# Altium schematic sheet ZCD.schdoc
size 253 x 78 mm
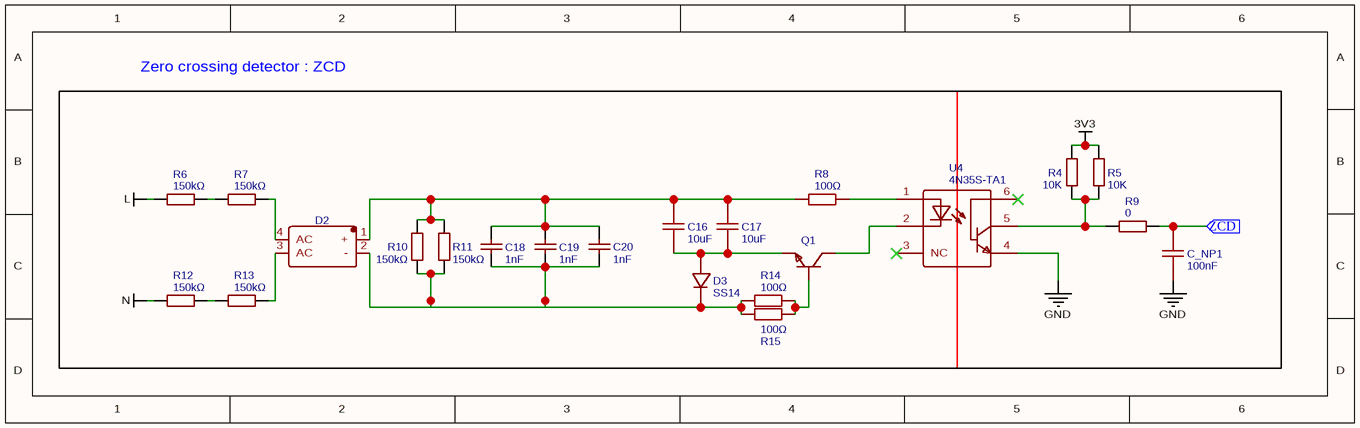
[diagram p0: ZCD.schdoc]

## Parts
C16  10uF  [C0805]
C17  10uF  [C0805]
C18  1nF  [C0603]
C19  1nF  [C0603]
C20  1nF  [C0603]
C_NP1  100nF  [C0603]
D2  MB6S_C211754  [MBS_L4.7-W3.8-P2.40-LS7.0-TL]  (value not drawn)
D3  SS14  [SMA_L4.4-W2.6-LS5.0-RD]
Q1  MMBT2222A,215  [SOT-23-3_L2.9-W1.6-P1.90-LS2.8-BR]  (value not drawn)
R4  10K  [R0603]
R5  10K  [R0603]
R6  150kΩ  [R1206]
R7  150kΩ  [R1206]
R8  100Ω  [R0603]
R9  0  [R0603]
R10  150kΩ  [R1206]
R11  150kΩ  [R1206]
R12  150kΩ  [R1206]
R13  150kΩ  [R1206]
R14  100Ω  [R0603]
R15  100Ω  [R0603]
U4  4N35S-TA1  [OPTO-SMD-6_L8.5-W6.5-P2.54-LS9.2-BL]

## Blocks framed on the sheet
Zero crossing detector : ZCD: C16-C20 C_NP1 D2 D3 Q1 R4-R15 U4

## Ports
ZCD (in)

## Nets
3V3: R4.2 R5.2
GND: C_NP1.2 U4.4
L: R6.1
N: R12.1
ZCD: C_NP1.1 R9.2 ; port ZCD
NetC16_1: C16.1 C17.1 D3.2(A) Q1.2(E)
NetC16_2: C16.2 C17.2 C18.2 C19.2 C20.2 D2.1(+) R8.1 R10.2 R11.2
NetC18_1: C18.1 C19.1 C20.1 D2.2(-) D3.1(C) R10.1 R11.1 R14.1 R15.2
NetD2_3: D2.3(AC) R13.2
NetD2_4: D2.4(AC) R7.2
NetQ1_1: Q1.1(B) R14.2 R15.1
NetQ1_3: Q1.3(C) U4.2(C)
NetR4_1: R4.1 R5.1 R9.1 U4.5
NetR6_2: R6.2 R7.1
NetR8_2: R8.2 U4.1(AN)
NetR12_2: R12.2 R13.1

Not connected (* = marked no-connect by the designer): U4 3(NC)* 6*

## Library data of the parts
C16 C17 = 10uF: BOM_Manufacturer: FH; BOM_Manufacturer Part: 0805F106M160NT; nameAlias: Capacitance; BOM_Supplier: LCSC; BOM_Supplier Part: C90545; BOM_JLCPCB Part Class: Extended Part; spicePre: C; spiceSymbolName: 0805F106M160NT
C18-C20 = 1nF: BOM_Manufacturer Part: CL10B102KB8NNNC; BOM_Manufacturer: SAMSUNG; nameAlias: Capacitance; BOM_Supplier: LCSC; BOM_Supplier Part: C1588; BOM_JLCPCB Part Class: Basic Part; spicePre: C; spiceSymbolName: CL10B102KB8NNNC
C_NP1 = 100nF: BOM_Manufacturer: SAMSUNG; BOM_Manufacturer Part: CL10B104KB8NNNC; nameAlias: Capacitance; BOM_Supplier: LCSC; BOM_Supplier Part: C1591; BOM_JLCPCB Part Class: Extended Part; spicePre: C; spiceSymbolName: CL10B104KB8NNNC
D2 = MB6S_C211754: BOM_Manufacturer: YANGJIE(扬杰); BOM_Manufacturer Part: MB6S; Contributor: LCSC; BOM_Supplier: LCSC; BOM_Supplier Part: C211754; BOM_JLCPCB Part Class: Extended Part; spicePre: D; spiceSymbolName: MB6S_C211754
D3 = SS14: BOM_Manufacturer: Jingdao; BOM_Supplier: LCSC; BOM_Manufacturer Part: SS14; BOM_Supplier Part: C112424; BOM_JLCPCB Part Class: Extended Part; spicePre: D; spiceSymbolName: SS14_C112424
Q1 = MMBT2222A,215: BOM_Manufacturer: Nexperia(安世); Contributor: LCSC; BOM_Supplier: LCSC; BOM_Manufacturer Part: MMBT2222A,215; BOM_Supplier Part: C179396; BOM_JLCPCB Part Class: Extended Part; spicePre: Q; spiceSymbolName: MMBT2222A,215
R4 R5 = 10K: BOM_Manufacturer: YAGEO; BOM_Manufacturer Part: RC0603FR-0710KL; nameAlias: Resistance (Ohms); Resistance: 10kΩ; BOM_Supplier: LCSC; BOM_Supplier Part: C98220; BOM_JLCPCB Part Class: Extended Part; spicePre: R; spiceSymbolName: RC0603FR-0710KL
R6 R7 R10-R13 = 150kΩ: BOM_Manufacturer: UNI-ROYAL(厚声); BOM_Manufacturer Part: 1206W4F1503T5E; nameAlias: Resistance; Resistance (Ohms): 150K; BOM_Supplier: LCSC; BOM_Supplier Part: C17916; BOM_JLCPCB Part Class: Extended Part; spicePre: R; spiceSymbolName: 1206W4F1503T5E
R8 R14 R15 = 100Ω: BOM_Manufacturer: ResistorToday; BOM_Manufacturer Part: AECR0603F100RK9; Resistance (Ohms): 100; nameAlias: Resistance; Contributor: LCSC; BOM_Supplier: LCSC; BOM_Supplier Part: C328334; BOM_JLCPCB Part Class: Extended Part; spicePre: R; spiceSymbolName: AECR0603F100RK9
R9 = 0: BOM_Manufacturer: YAGEO; BOM_Manufacturer Part: RC0603JR-070RL; nameAlias: Resistance (Ohms); Resistance: 0Ω; BOM_Supplier: LCSC; BOM_Supplier Part: C95177; BOM_JLCPCB Part Class: Extended Part; spicePre: R; spiceSymbolName: RC0603JR-070RL
U4 = 4N35S-TA1: BOM_Manufacturer: LITEON; Contributor: LCSC; BOM_Supplier: LCSC; BOM_Manufacturer Part: 4N35S-TA1; BOM_Supplier Part: C115444; BOM_JLCPCB Part Class: Extended Part; spicePre: U; spiceSymbolName: 4N35S-TA1